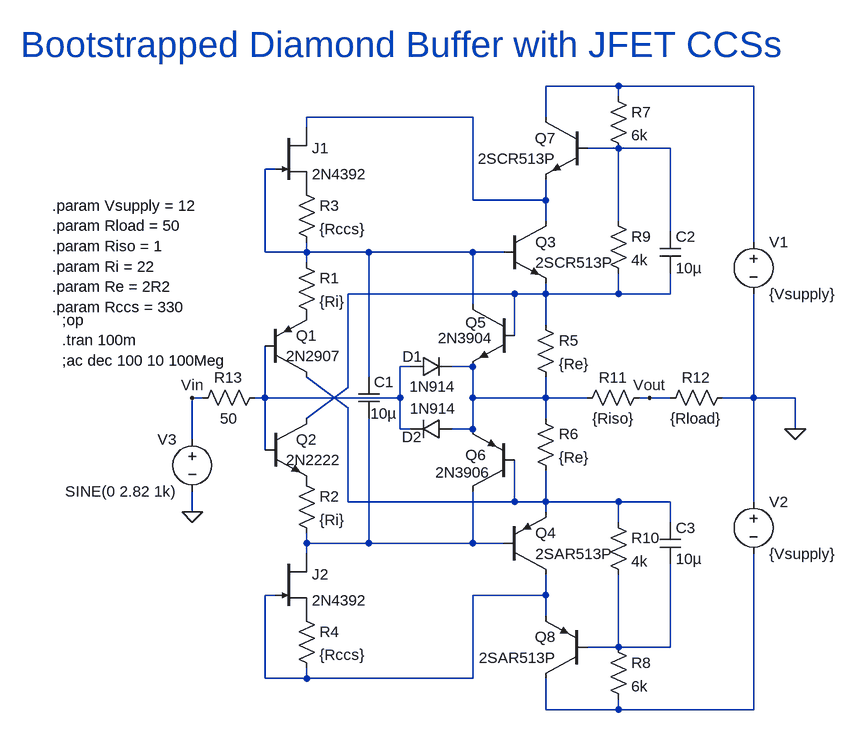
[diagram p0: schematic DDB_bootstraped.asc]
DDB_bootstraped.asc, the LTspice schematic file:
Version 4
SHEET 1 2008 808
WIRE 880 -224 768 -224
WIRE 1088 -224 880 -224
WIRE 880 -208 880 -224
WIRE 656 -176 400 -176
WIRE 768 -176 768 -224
WIRE 400 -160 400 -176
WIRE 880 -128 832 -128
WIRE 960 -128 880 -128
WIRE 352 -96 336 -96
WIRE 656 -48 656 -176
WIRE 768 -48 768 -80
WIRE 768 -48 656 -48
WIRE 768 -16 768 -48
WIRE 880 -16 880 -128
WIRE 960 0 960 -128
WIRE 1088 16 1088 -224
WIRE 336 32 336 -96
WIRE 400 32 400 16
WIRE 400 32 336 32
WIRE 496 32 400 32
WIRE 656 32 496 32
WIRE 704 32 656 32
WIRE 400 48 400 32
WIRE 720 96 464 96
WIRE 768 96 768 80
WIRE 768 96 720 96
WIRE 880 96 880 64
WIRE 880 96 768 96
WIRE 960 96 960 64
WIRE 960 96 880 96
WIRE 656 112 656 32
WIRE 768 144 768 96
WIRE 720 160 720 96
WIRE 560 208 544 208
WIRE 656 208 624 208
WIRE 496 224 496 32
WIRE 464 240 464 96
WIRE 240 256 224 256
WIRE 336 256 336 176
WIRE 336 256 320 256
WIRE 544 256 544 208
WIRE 544 256 336 256
WIRE 656 256 656 208
WIRE 768 256 768 224
WIRE 768 256 656 256
WIRE 832 256 768 256
WIRE 928 256 912 256
WIRE 960 256 928 256
WIRE 1088 256 1088 96
WIRE 1088 256 1040 256
WIRE 1152 256 1088 256
WIRE 464 272 400 224
WIRE 400 288 464 240
WIRE 768 288 768 256
WIRE 544 304 544 256
WIRE 560 304 544 304
WIRE 656 304 656 256
WIRE 656 304 624 304
WIRE 1152 304 1152 256
WIRE 224 320 224 256
WIRE 336 336 336 256
WIRE 464 416 464 272
WIRE 720 416 720 352
WIRE 720 416 464 416
WIRE 768 416 768 368
WIRE 768 416 720 416
WIRE 880 416 768 416
WIRE 960 416 880 416
WIRE 1088 416 1088 256
WIRE 224 432 224 400
WIRE 768 432 768 416
WIRE 880 448 880 416
WIRE 960 448 960 416
WIRE 400 480 400 464
WIRE 496 480 496 288
WIRE 496 480 400 480
WIRE 656 480 656 400
WIRE 656 480 496 480
WIRE 704 480 656 480
WIRE 400 496 400 480
WIRE 352 560 336 560
WIRE 768 560 768 528
WIRE 768 560 656 560
WIRE 768 592 768 560
WIRE 880 640 880 528
WIRE 880 640 832 640
WIRE 960 640 960 512
WIRE 960 640 880 640
WIRE 336 688 336 560
WIRE 400 688 400 672
WIRE 400 688 336 688
WIRE 656 688 656 560
WIRE 656 688 400 688
WIRE 768 736 768 688
WIRE 880 736 880 720
WIRE 880 736 768 736
WIRE 1088 736 1088 496
WIRE 1088 736 880 736
FLAG 1152 304 0
FLAG 224 432 0
FLAG 928 256 Vout
FLAG 224 256 Vin
SYMBOL pnp 336 224 M180
WINDOW 0 48 64 Left 2
WINDOW 3 32 32 Left 2
SYMATTR InstName Q1
SYMATTR Value 2N2907
SYMBOL npn 336 288 R0
WINDOW 0 48 32 Left 2
WINDOW 3 32 64 Left 2
SYMATTR InstName Q2
SYMATTR Value 2N2222
SYMBOL res 384 32 R0
SYMATTR InstName R1
SYMATTR Value {Ri}
SYMBOL res 384 368 R0
SYMATTR InstName R2
SYMATTR Value {Ri}
SYMBOL njf 352 -160 R0
SYMATTR InstName J1
SYMATTR Value 2N4392
SYMBOL njf 352 496 R0
SYMATTR InstName J2
SYMATTR Value 2N4392
SYMBOL res 384 -80 R0
SYMATTR InstName R3
SYMATTR Value {Rccs}
SYMBOL res 384 576 R0
SYMATTR InstName R4
SYMATTR Value {Rccs}
SYMBOL npn 704 -16 R0
WINDOW 0 48 32 Left 2
WINDOW 3 48 64 Left 2
SYMATTR InstName Q3
SYMATTR Value 2SCR513P
SYMBOL pnp 704 528 M180
WINDOW 0 48 64 Left 2
WINDOW 3 48 32 Left 2
SYMATTR InstName Q4
SYMATTR Value 2SAR513P
SYMBOL npn 720 112 M0
WINDOW 0 43 28 Left 2
WINDOW 3 33 52 Left 2
SYMATTR InstName Q5
SYMATTR Value 2N3904
SYMBOL pnp 720 400 R180
WINDOW 0 43 56 Left 2
WINDOW 3 37 29 Left 2
SYMATTR InstName Q6
SYMATTR Value 2N3906
SYMBOL res 752 128 R0
SYMATTR InstName R5
SYMATTR Value {Re}
SYMBOL res 752 272 R0
SYMATTR InstName R6
SYMATTR Value {Re}
SYMBOL cap 480 224 R0
WINDOW 3 18 56 Left 2
SYMATTR InstName C1
SYMATTR Value 10µ
SYMBOL diode 560 224 R270
WINDOW 0 16 3 VTop 2
WINDOW 3 1 34 VBottom 2
SYMATTR InstName D1
SYMATTR Value 1N914
SYMBOL diode 624 288 R90
WINDOW 0 44 62 VBottom 2
WINDOW 3 -31 29 VTop 2
SYMATTR InstName D2
SYMATTR Value 1N914
SYMBOL npn 832 -176 M0
WINDOW 0 48 32 Left 2
WINDOW 3 48 64 Left 2
SYMATTR InstName Q7
SYMATTR Value 2SCR513P
SYMBOL pnp 832 688 R180
WINDOW 0 48 64 Left 2
WINDOW 3 48 32 Left 2
SYMATTR InstName Q8
SYMATTR Value 2SAR513P
SYMBOL res 864 -224 R0
SYMATTR InstName R7
SYMATTR Value 6k
SYMBOL res 864 624 R0
SYMATTR InstName R8
SYMATTR Value 6k
SYMBOL res 864 -32 R0
SYMATTR InstName R9
SYMATTR Value 4k
SYMBOL res 864 432 R0
SYMATTR InstName R10
SYMATTR Value 4k
SYMBOL cap 944 0 R0
SYMATTR InstName C2
SYMATTR Value 10µ
SYMBOL cap 944 448 R0
SYMATTR InstName C3
SYMATTR Value 10µ
SYMBOL res 928 240 R90
WINDOW 0 0 56 VBottom 2
WINDOW 3 32 56 VTop 2
SYMATTR InstName R11
SYMATTR Value {Riso}
SYMBOL res 1056 240 R90
WINDOW 0 0 56 VBottom 2
WINDOW 3 32 56 VTop 2
SYMATTR InstName R12
SYMATTR Value {Rload}
SYMBOL voltage 1088 0 R0
SYMATTR InstName V1
SYMATTR Value {Vsupply}
SYMBOL voltage 1088 400 R0
SYMATTR InstName V2
SYMATTR Value {Vsupply}
SYMBOL voltage 224 304 M0
SYMATTR InstName V3
SYMATTR Value SINE(0 2.82 1k)
SYMBOL res 336 240 R90
WINDOW 0 0 56 VBottom 2
WINDOW 3 32 56 VTop 2
SYMATTR InstName R13
SYMATTR Value 50
TEXT 8 -40 Left 2 !.param Vsupply = 12\n.param Rload = 50\n.param Riso = 1\n.param Ri = 22\n.param Re = 2R2\n.param Rccs = 330
TEXT 24 136 Left 2 !;op\n.tran 100m\n;ac dec 100 10 100Meg
TEXT -40 -288 Left 5 ;Bootstrapped Diamond Buffer with JFET CCSs

The netlist it stands for:
* DDB_bootstraped.asc
Q1 N008 N006 P001 0 2N2907
Q2 N005 N006 P002 0 2N2222
R1 N004 P001 {Ri}
R2 P002 N009 {Ri}
J1 N002 N004 P003 2N4392
J2 N009 N010 P004 2N4392
R3 P003 N004 {Rccs}
R4 P004 N010 {Rccs}
Q3 N002 N004 N005 0 2SCR513P
Q4 N010 N009 N008 0 2SAR513P
Q5 N004 N005 N007 0 2N3904
Q6 N009 N008 N007 0 2N3906
R5 N005 N007 {Re}
R6 N007 N008 {Re}
C1 N004 N009 10µ
D1 N006 N007 1N914
D2 N007 N006 1N914
Q7 N001 N003 N002 0 2SCR513P
Q8 N012 N011 N010 0 2SAR513P
R7 N001 N003 6k
R8 N011 N012 6k
R9 N003 N005 4k
R10 N008 N011 4k
C2 N003 N005 10µ
C3 N008 N011 10µ
R11 Vout N007 {Riso}
R12 0 Vout {Rload}
V1 N001 0 {Vsupply}
V2 0 N012 {Vsupply}
V3 Vin 0 SINE(0 2.82 1k)
R13 N006 Vin 50
.model D D
.lib standard.dio
.model NPN NPN
.model PNP PNP
.lib standard.bjt
.model NJF NJF
.model PJF PJF
.lib standard.jft
.param Vsupply = 12
.param Rload = 50
.param Riso = 1
.param Ri = 22
.param Re = 2R2
.param Rccs = 330
;op
.tran 100m
;ac dec 100 10 100Meg
* Bootstrapped Diamond Buffer with JFET CCSs
.backanno
.end